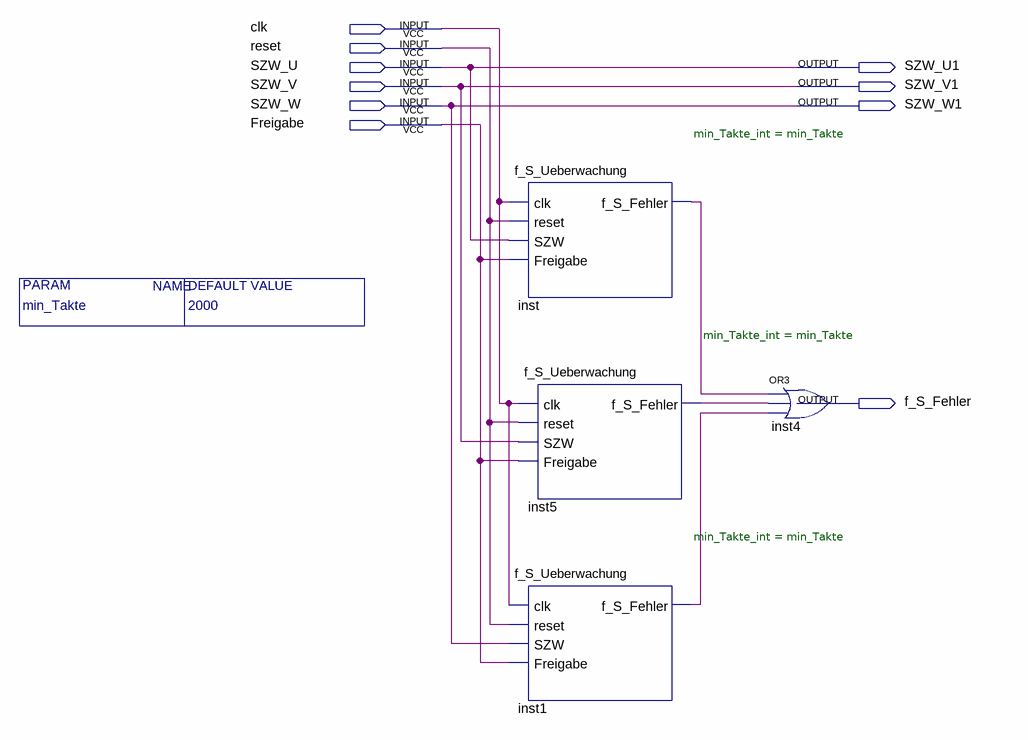
[diagram p0: schematic sheet]
// Quartus schematic f_S_Fehler.bdf as structural Verilog: 4 symbols, 10 pins
module f_S_Fehler #(parameter min_Takte = 2000) (
  input  clk,
  input  reset,
  input  SZW_U,
  input  SZW_V,
  input  SZW_W,
  input  Freigabe,
  output SZW_U1,
  output SZW_V1,
  output SZW_W1,
  output f_S_Fehler
);

  wire inst1_f_s_fehler, inst5_f_s_fehler, inst_f_s_fehler;

  f_S_Ueberwachung #(.min_Takte_int(min_Takte)) inst (
    .clk(clk), .reset(reset), .SZW(SZW_U), .Freigabe(Freigabe), .f_S_Fehler(inst_f_s_fehler));
  f_S_Ueberwachung #(.min_Takte_int(min_Takte)) inst1 (
    .clk(clk), .reset(reset), .SZW(SZW_W), .Freigabe(Freigabe), .f_S_Fehler(inst1_f_s_fehler));
  f_S_Ueberwachung #(.min_Takte_int(min_Takte)) inst5 (
    .clk(clk), .reset(reset), .SZW(SZW_V), .Freigabe(Freigabe), .f_S_Fehler(inst5_f_s_fehler));
  or inst4 (f_S_Fehler, inst_f_s_fehler, inst5_f_s_fehler, inst1_f_s_fehler);

  assign SZW_U1 = SZW_U;
  assign SZW_V1 = SZW_V;
  assign SZW_W1 = SZW_W;
endmodule
